# Altium project SlimBoxPCB.PrjPcb
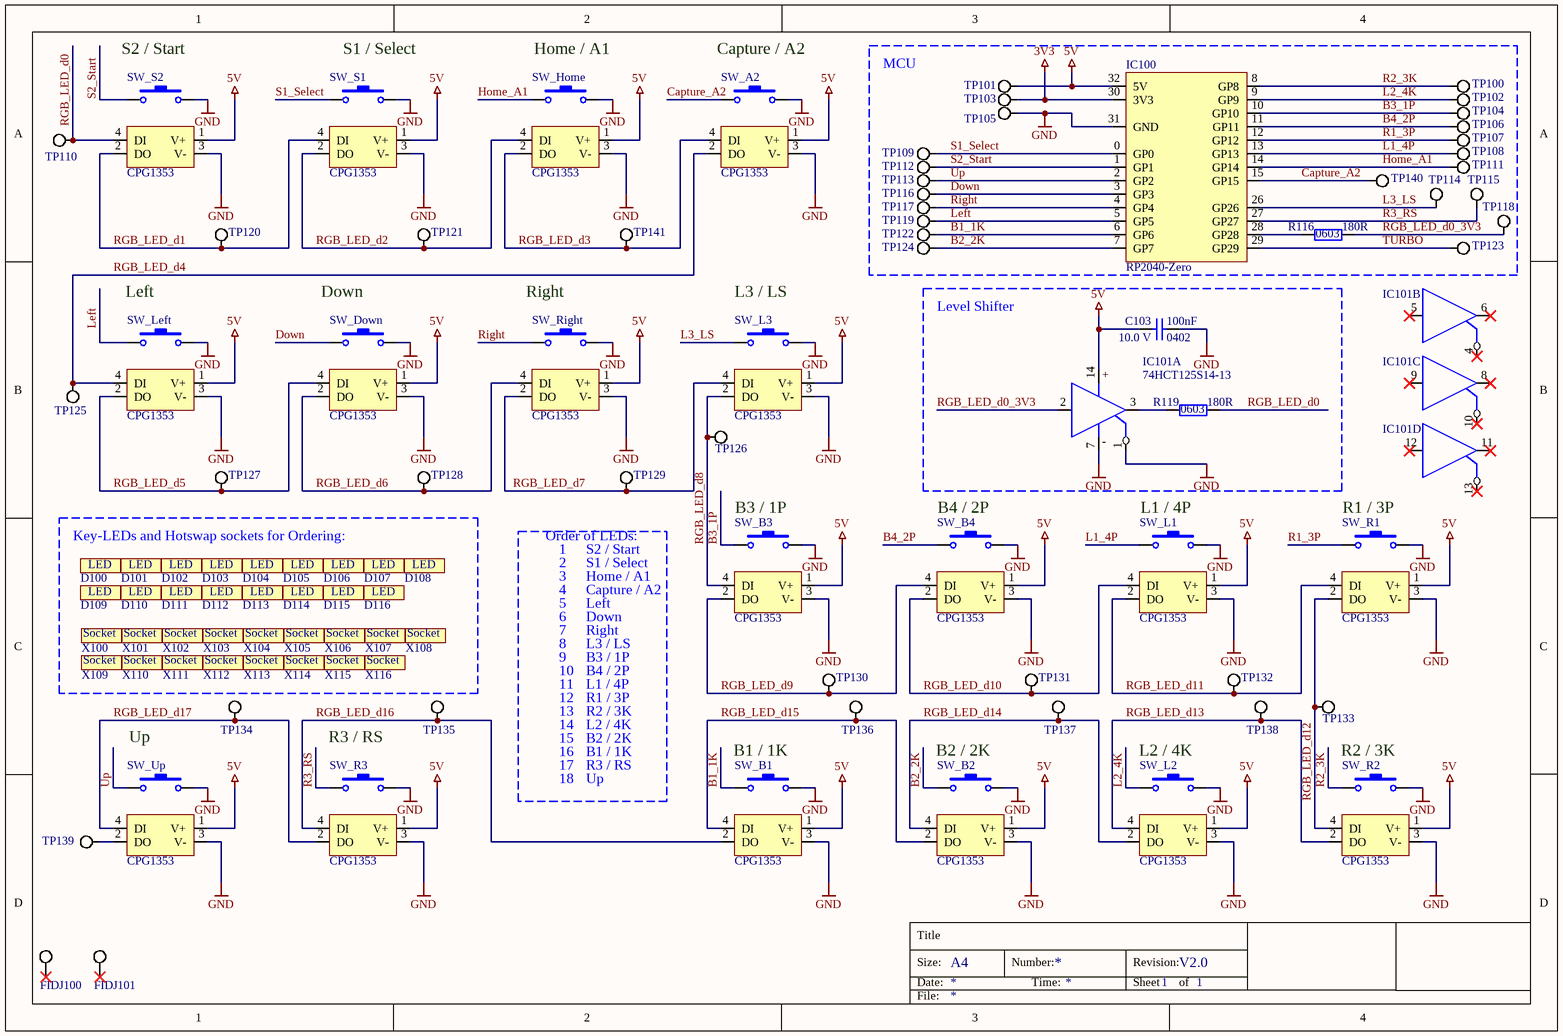
[diagram p0: Sheet1_Overview.SchDoc]
ProjectName: SlimBox; Revision: V2.0; Signature1: M.Tetard / P. Tran; Signature2: 2024-01 / Freiburg
1 sheet, 101 parts. Net scope: global (net labels, ports and power ports of the same name join across sheets).

## Sheet Sheet1_Overview.SchDoc: =ProjectName
size A4; Organization: M.Tetard / P. Tran; Address1: 2024-01 / Freiburg; Revision: V2.0; SheetNumber: 1; SheetTotal: 1

### Parts
C103  Capacitance: 100nF  Footprint: 0402  Voltage: 10.0 V  [C_0402]  (hidden comment: C 100nF 0402 10V)
D100  LED RGB  (value not drawn)  (mechanical)
D101  LED RGB  (value not drawn)  (mechanical)
D102  LED RGB  (value not drawn)  (mechanical)
D103  LED RGB  (value not drawn)  (mechanical)
D104  LED RGB  (value not drawn)  (mechanical)
D105  LED RGB  (value not drawn)  (mechanical)
D106  LED RGB  (value not drawn)  (mechanical)
D107  LED RGB  (value not drawn)  (mechanical)
D108  LED RGB  (value not drawn)  (mechanical)
D109  LED RGB  (value not drawn)  (mechanical)
D110  LED RGB  (value not drawn)  (mechanical)
D111  LED RGB  (value not drawn)  (mechanical)
D112  LED RGB  (value not drawn)  (mechanical)
D113  LED RGB  (value not drawn)  (mechanical)
D114  LED RGB  (value not drawn)  (mechanical)
D115  LED RGB  (value not drawn)  (mechanical)
D116  LED RGB  (value not drawn)  (mechanical)
FIDJ100  Fiducial  [FIDJ_1mm]  (value not drawn)  (net tie, no BOM)
FIDJ101  Fiducial  [FIDJ_1mm]  (value not drawn)  (net tie, no BOM)
IC100  RP2040-Zero  [IC_RP2040-Zero]
IC101  74HCT125S14-13  [SOIC-14]  (parts A,B,C,D of 4)
R116  Resistance: 180R  Footprint: 0603  [R_0603]  (hidden comment: R 180R 0603)
R119  Resistance: 180R  Footprint: 0603  [R_0603]  (hidden comment: R 180R 0603)
SW_A2  CPG1353  [SW_Kailh_CPG1353]
SW_B1  CPG1353  [SW_Kailh_CPG1353]
SW_B2  CPG1353  [SW_Kailh_CPG1353]
SW_B3  CPG1353  [SW_Kailh_CPG1353]
SW_B4  CPG1353  [SW_Kailh_CPG1353]
SW_Down  CPG1353  [SW_Kailh_CPG1353]
SW_Home  CPG1353  [SW_Kailh_CPG1353]
SW_L1  CPG1353  [SW_Kailh_CPG1353]
SW_L2  CPG1353  [SW_Kailh_CPG1353]
SW_L3  CPG1353  [SW_Kailh_CPG1353]
SW_Left  CPG1353  [SW_Kailh_CPG1353]
SW_R1  CPG1353  [SW_Kailh_CPG1353]
SW_R2  CPG1353  [SW_Kailh_CPG1353]
SW_R3  CPG1353  [SW_Kailh_CPG1353]
SW_Right  CPG1353  [SW_Kailh_CPG1353]
SW_S1  CPG1353  [SW_Kailh_CPG1353]
SW_S2  CPG1353  [SW_Kailh_CPG1353]
SW_Up  CPG1353  [SW_Kailh_CPG1353]
TP100  TP  [TP_1mm]  (value not drawn)  (net tie, no BOM)
TP101  TP  [TP_1mm]  (value not drawn)  (net tie, no BOM)
TP102  TP  [TP_1mm]  (value not drawn)  (net tie, no BOM)
TP103  TP  [TP_1mm]  (value not drawn)  (net tie, no BOM)
TP104  TP  [TP_1mm]  (value not drawn)  (net tie, no BOM)
TP105  TP  [TP_1mm]  (value not drawn)  (net tie, no BOM)
TP106  TP  [TP_1mm]  (value not drawn)  (net tie, no BOM)
TP107  TP  [TP_1mm]  (value not drawn)  (net tie, no BOM)
TP108  TP  [TP_1mm]  (value not drawn)  (net tie, no BOM)
TP109  TP  [TP_1mm]  (value not drawn)  (net tie, no BOM)
TP110  TP  [TP_1mm]  (value not drawn)  (net tie, no BOM)
TP111  TP  [TP_1mm]  (value not drawn)  (net tie, no BOM)
TP112  TP  [TP_1mm]  (value not drawn)  (net tie, no BOM)
TP113  TP  [TP_1mm]  (value not drawn)  (net tie, no BOM)
TP114  TP  [TP_1mm]  (value not drawn)  (net tie, no BOM)
TP115  TP  [TP_1mm]  (value not drawn)  (net tie, no BOM)
TP116  TP  [TP_1mm]  (value not drawn)  (net tie, no BOM)
TP117  TP  [TP_1mm]  (value not drawn)  (net tie, no BOM)
TP118  TP  [TP_1mm]  (value not drawn)  (net tie, no BOM)
TP119  TP  [TP_1mm]  (value not drawn)  (net tie, no BOM)
TP120  TP  [TP_1mm]  (value not drawn)  (net tie, no BOM)
TP121  TP  [TP_1mm]  (value not drawn)  (net tie, no BOM)
TP122  TP  [TP_1mm]  (value not drawn)  (net tie, no BOM)
TP123  TP  [TP_1mm]  (value not drawn)  (net tie, no BOM)
TP124  TP  [TP_1mm]  (value not drawn)  (net tie, no BOM)
TP125  TP  [TP_1mm]  (value not drawn)  (net tie, no BOM)
TP126  TP  [TP_1mm]  (value not drawn)  (net tie, no BOM)
TP127  TP  [TP_1mm]  (value not drawn)  (net tie, no BOM)
TP128  TP  [TP_1mm]  (value not drawn)  (net tie, no BOM)
TP129  TP  [TP_1mm]  (value not drawn)  (net tie, no BOM)
TP130  TP  [TP_1mm]  (value not drawn)  (net tie, no BOM)
TP131  TP  [TP_1mm]  (value not drawn)  (net tie, no BOM)
TP132  TP  [TP_1mm]  (value not drawn)  (net tie, no BOM)
TP133  TP  [TP_1mm]  (value not drawn)  (net tie, no BOM)
TP134  TP  [TP_1mm]  (value not drawn)  (net tie, no BOM)
TP135  TP  [TP_1mm]  (value not drawn)  (net tie, no BOM)
TP136  TP  [TP_1mm]  (value not drawn)  (net tie, no BOM)
TP137  TP  [TP_1mm]  (value not drawn)  (net tie, no BOM)
TP138  TP  [TP_1mm]  (value not drawn)  (net tie, no BOM)
TP139  TP  [TP_1mm]  (value not drawn)  (net tie, no BOM)
TP140  TP  [TP_1mm]  (value not drawn)  (net tie, no BOM)
TP141  TP  [TP_1mm]  (value not drawn)  (net tie, no BOM)
X100  Socket  (value not drawn)  (mechanical)
X101  Socket  (value not drawn)  (mechanical)
X102  Socket  (value not drawn)  (mechanical)
X103  Socket  (value not drawn)  (mechanical)
X104  Socket  (value not drawn)  (mechanical)
X105  Socket  (value not drawn)  (mechanical)
X106  Socket  (value not drawn)  (mechanical)
X107  Socket  (value not drawn)  (mechanical)
X108  Socket  (value not drawn)  (mechanical)
X109  Socket  (value not drawn)  (mechanical)
X110  Socket  (value not drawn)  (mechanical)
X111  Socket  (value not drawn)  (mechanical)
X112  Socket  (value not drawn)  (mechanical)
X113  Socket  (value not drawn)  (mechanical)
X114  Socket  (value not drawn)  (mechanical)
X115  Socket  (value not drawn)  (mechanical)
X116  Socket  (value not drawn)  (mechanical)

### Blocks framed on the sheet
MCU: IC100 R116 TP100-TP109 TP111-TP119 TP122-TP124 TP140
Level Shifter: C103 IC101 R119
Key-LEDs and Hotswap sockets for Ordering:: D100-D116 X100-X116

### Nets
3V3: IC100.30(3V3) TP103.1(TP)
5V: C103.1 IC100.32(5V) IC101.14(VCC) SW_A2.1(V+) SW_B1.1(V+) SW_B2.1(V+) SW_B3.1(V+) SW_B4.1(V+) SW_Down.1(V+) SW_Home.1(V+) SW_L1.1(V+) SW_L2.1(V+) SW_L3.1(V+) SW_Left.1(V+) SW_R1.1(V+) SW_R2.1(V+) SW_R3.1(V+) SW_Right.1(V+) SW_S1.1(V+) SW_S2.1(V+) SW_Up.1(V+) TP101.1(TP)
GND: C103.2 IC100.31(GND) IC101.1(n1OE) IC101.7(GND) SW_A2.3(V-) SW_A2.B SW_B1.3(V-) SW_B1.B SW_B2.3(V-) SW_B2.B SW_B3.3(V-) SW_B3.B SW_B4.3(V-) SW_B4.B SW_Down.3(V-) SW_Down.B SW_Home.3(V-) SW_Home.B SW_L1.3(V-) SW_L1.B SW_L2.3(V-) SW_L2.B SW_L3.3(V-) SW_L3.B SW_Left.3(V-) SW_Left.B SW_R1.3(V-) SW_R1.B SW_R2.3(V-) SW_R2.B SW_R3.3(V-) SW_R3.B SW_Right.3(V-) SW_Right.B SW_S1.3(V-) SW_S1.B SW_S2.3(V-) SW_S2.B SW_Up.3(V-) SW_Up.B TP105.1(TP)
B1_1K: IC100.6(GP6) SW_B1.A TP122.1(TP)
B2_2K: IC100.7(GP7) SW_B2.A TP124.1(TP)
B3_1P: IC100.10(GP10) SW_B3.A TP104.1(TP)
B4_2P: IC100.11(GP11) SW_B4.A TP106.1(TP)
Capture_A2: IC100.15(GP15) SW_A2.A TP140.1(TP)
Down: IC100.3(GP3) SW_Down.A TP116.1(TP)
Home_A1: IC100.14(GP14) SW_Home.A TP111.1(TP)
L1_4P: IC100.13(GP13) SW_L1.A TP108.1(TP)
L2_4K: IC100.9(GP9) SW_L2.A TP102.1(TP)
L3_LS: IC100.26(GP26) SW_L3.A TP114.1(TP)
Left: IC100.5(GP5) SW_Left.A TP119.1(TP)
R1_3P: IC100.12(GP12) SW_R1.A TP107.1(TP)
R2_3K: IC100.8(GP8) SW_R2.A TP100.1(TP)
R3_RS: IC100.27(GP27) SW_R3.A TP115.1(TP)
RGB_LED_d0: R119.2 SW_S2.4(DI) TP110.1(TP)
RGB_LED_d0_3V3: IC101.2(1A) R116.2 TP118.1(TP)
RGB_LED_d1: SW_S1.4(DI) SW_S2.2(DO) TP120.1(TP)
RGB_LED_d2: SW_Home.4(DI) SW_S1.2(DO) TP121.1(TP)
RGB_LED_d3: SW_A2.4(DI) SW_Home.2(DO) TP141.1(TP)
RGB_LED_d4: SW_A2.2(DO) SW_Left.4(DI) TP125.1(TP)
RGB_LED_d5: SW_Down.4(DI) SW_Left.2(DO) TP127.1(TP)
RGB_LED_d6: SW_Down.2(DO) SW_Right.4(DI) TP128.1(TP)
RGB_LED_d7: SW_L3.4(DI) SW_Right.2(DO) TP129.1(TP)
RGB_LED_d8: SW_B3.4(DI) SW_L3.2(DO) TP126.1(TP)
RGB_LED_d9: SW_B3.2(DO) SW_B4.4(DI) TP130.1(TP)
RGB_LED_d10: SW_B4.2(DO) SW_L1.4(DI) TP131.1(TP)
RGB_LED_d11: SW_L1.2(DO) SW_R1.4(DI) TP132.1(TP)
RGB_LED_d12: SW_R1.2(DO) SW_R2.4(DI) TP133.1(TP)
RGB_LED_d13: SW_L2.4(DI) SW_R2.2(DO) TP138.1(TP)
RGB_LED_d14: SW_B2.4(DI) SW_L2.2(DO) TP137.1(TP)
RGB_LED_d15: SW_B1.4(DI) SW_B2.2(DO) TP136.1(TP)
RGB_LED_d16: SW_B1.2(DO) SW_R3.4(DI) TP135.1(TP)
RGB_LED_d17: SW_R3.2(DO) SW_Up.4(DI) TP134.1(TP)
Right: IC100.4(GP4) SW_Right.A TP117.1(TP)
S1_Select: IC100.0(GP0) SW_S1.A TP109.1(TP)
S2_Start: IC100.1(GP1) SW_S2.A TP112.1(TP)
TURBO: IC100.29(GP29) TP123.1(TP)
Up: IC100.2(GP2) SW_Up.A TP113.1(TP)
NetIC100_28: IC100.28(GP28) R116.1
NetIC101_3: IC101.3(1Y) R119.1
NetSW_Up_2: SW_Up.2(DO) TP139.1(TP)

Not connected (* = marked no-connect by the designer): FIDJ100 1*; FIDJ101 1*; IC101 4(n2OE)* 5(2A)* 6(2Y)* 8(3Y)* 9(3A)* 10(n3OE)* 11(4Y)* 12(4A)* 13(n4OE)*

### Notes on the sheet
- (near SW_S2) S2 / Start
- (near SW_S1) S1 / Select
- (near SW_Home) Home / A1
- (near SW_A2) Capture / A2
- (near SW_Left) Left
- (near SW_Down) Down
- (near SW_Right) Right
- (near SW_L3) L3 / LS
- (near SW_B3) B3 / 1P
- (near SW_B4) B4 / 2P
- (near SW_L1) L1 / 4P
- R1 / 3P
- (near TP129) Order of LEDs:
- 1
- 2
- 3
- S2 / Start
- S1 / Select
- Home / A1
- 4
- 5
- 6
- 7
- 8
- Left
- Down
- Right
- L3 / LS
- Capture / A2
- 9
- 10
- 11
- 12
- 13
- B3 / 1P
- B4 / 2P
- L1 / 4P
- R2 / 3K
- (near SW_Up) Up
- R3 / RS
- 14
- 15
- 16
- 17
- 18
- L2 / 4K
- B2 / 2K
- B1 / 1K
- Up
- (near SW_B1) B1 / 1K
- (near SW_B2) B2 / 2K
- (near SW_L2) L2 / 4K
- Title
- Size:
- Date:
- A4
- Number:
- Time:
- Revision:
- Sheet
- of
- File:
- (in symbol IC_Logic_1BUF_4CH, part A) +; -
- (in symbol SW_CPG1353_LED) LED

### Library data of the parts
C103 = CAP_100nF_10V_0402: CAP CER 0.1UF 10V X5R 0402; Manufacturer: Samsung Electro-Mechanics; Manufacturer Part Number: CL05A104MP5NNNC; Type: Capacitor; Supplier 1: Digi-Key; Supplier Part Number 1: 1276-1443-1-ND
D100-D116 = SW_CPG1353_LED: LED for SW_CPG1353; Manufacturer: Opsco; Manufacturer Part Number: SK6812Mini-E; Type: other, switch
FIDJ100 FIDJ101 = FIDJ_1mm: Fiducal 1mm
IC100 = IC_RP2040-Zero: Waveshare RP2040-Zero Module; Manufacturer: Waveshare; Manufacturer Part Number: RP2040-Zero; Type: other, module
IC101 = IC_Logic_1BUF_4CH: IC BUFFER NON-INVERT 5.5V 14SO; Manufacturer: Diodes Incorporated; Type: IC; Supplier 1: Digi-Key; Supplier Part Number 1: 74HCT125S14-13-ND; Manufacturer Part Number: 74HCT125S14-13
R116 R119 = R_180R_0603: RES 180 OHM 1% 1/10W 0603; Manufacturer: Stackpole Electronics Inc; Manufacturer Part Number: RMCF0603FT180R; Type: Resistor; Supplier 1: Digi-Key; Supplier Part Number 1: RMCF0603FT180RCT-ND
SW_A2 SW_B1-SW_B4 SW_Down SW_Home SW_L1-SW_L3 SW_Left SW_R1-SW_R3 SW_Right SW_S1 SW_S2 SW_Up = SW_CPG1353_HS_LED: Kailh Choc low profile switches V2 (CPG1353) /w Hotswap, LED; Manufacturer: Kailh; Manufacturer Part Number: CPG1353; Type: other, switch
TP100-TP141 = TP_1mm: Test Point 1mm
X100-X116 = SW_CPG1353_socket: Socket for SW_CPG1353; Manufacturer: Kailh; Manufacturer Part Number: PG1350; Type: other

## Assembly variants
Variant1: all parts fitted